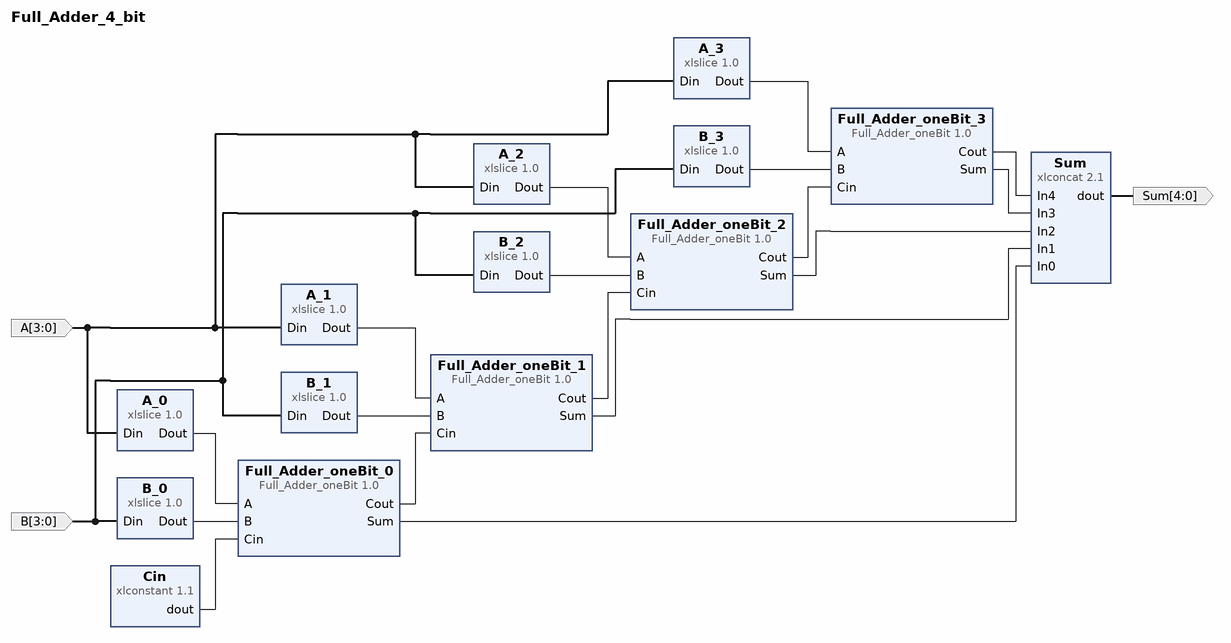
[diagram p0: block diagram of the top level]
# Vivado block design Full_Adder_4_bit, xc7vx485tffg1157-1, Vivado 2025.1
create_bd_design Full_Adder_4_bit

create_bd_port -dir I -from 3 -to 0 A
create_bd_port -dir I -from 3 -to 0 B
create_bd_port -dir O -from 4 -to 0 Sum

create_bd_cell -type ip -vlnv xilinx.com:user:Full_Adder_oneBit:1.0 Full_Adder_oneBit_0
create_bd_cell -type ip -vlnv xilinx.com:ip:xlslice:1.0 A_0
set_property -dict {CONFIG.DIN_WIDTH 4} [get_bd_cells A_0]
create_bd_cell -type ip -vlnv xilinx.com:ip:xlslice:1.0 A_1
set_property -dict {CONFIG.DIN_FROM 1 CONFIG.DIN_TO 1 CONFIG.DIN_WIDTH 4} [get_bd_cells A_1]
create_bd_cell -type ip -vlnv xilinx.com:ip:xlslice:1.0 A_2
set_property -dict {CONFIG.DIN_FROM 2 CONFIG.DIN_TO 2 CONFIG.DIN_WIDTH 4} [get_bd_cells A_2]
create_bd_cell -type ip -vlnv xilinx.com:ip:xlslice:1.0 A_3
set_property -dict {CONFIG.DIN_FROM 3 CONFIG.DIN_TO 3 CONFIG.DIN_WIDTH 4} [get_bd_cells A_3]
create_bd_cell -type ip -vlnv xilinx.com:ip:xlslice:1.0 B_0
set_property -dict {CONFIG.DIN_WIDTH 4} [get_bd_cells B_0]
create_bd_cell -type ip -vlnv xilinx.com:ip:xlslice:1.0 B_1
set_property -dict {CONFIG.DIN_FROM 1 CONFIG.DIN_TO 1 CONFIG.DIN_WIDTH 4} [get_bd_cells B_1]
create_bd_cell -type ip -vlnv xilinx.com:ip:xlslice:1.0 B_2
set_property -dict {CONFIG.DIN_FROM 2 CONFIG.DIN_TO 2 CONFIG.DIN_WIDTH 4} [get_bd_cells B_2]
create_bd_cell -type ip -vlnv xilinx.com:ip:xlslice:1.0 B_3
set_property -dict {CONFIG.DIN_FROM 3 CONFIG.DIN_TO 3 CONFIG.DIN_WIDTH 4} [get_bd_cells B_3]
create_bd_cell -type ip -vlnv xilinx.com:user:Full_Adder_oneBit:1.0 Full_Adder_oneBit_1
create_bd_cell -type ip -vlnv xilinx.com:user:Full_Adder_oneBit:1.0 Full_Adder_oneBit_2
create_bd_cell -type ip -vlnv xilinx.com:user:Full_Adder_oneBit:1.0 Full_Adder_oneBit_3
create_bd_cell -type ip -vlnv xilinx.com:ip:xlconstant:1.1 Cin
set_property -dict {CONFIG.CONST_VAL 0} [get_bd_cells Cin]
create_bd_cell -type ip -vlnv xilinx.com:ip:xlconcat:2.1 Sum
set_property -dict {CONFIG.NUM_PORTS 5} [get_bd_cells Sum]

# ---- connections ----

connect_bd_net [get_bd_pins A_0/Dout] [get_bd_pins Full_Adder_oneBit_0/A]
connect_bd_net [get_bd_ports A] [get_bd_pins A_0/Din] [get_bd_pins A_1/Din] [get_bd_pins A_2/Din] [get_bd_pins A_3/Din]
connect_bd_net [get_bd_pins A_1/Dout] [get_bd_pins Full_Adder_oneBit_1/A]
connect_bd_net [get_bd_pins A_2/Dout] [get_bd_pins Full_Adder_oneBit_2/A]
connect_bd_net [get_bd_pins A_3/Dout] [get_bd_pins Full_Adder_oneBit_3/A]
connect_bd_net [get_bd_pins B_0/Dout] [get_bd_pins Full_Adder_oneBit_0/B]
connect_bd_net [get_bd_pins B_1/Dout] [get_bd_pins Full_Adder_oneBit_1/B]
connect_bd_net [get_bd_pins B_2/Dout] [get_bd_pins Full_Adder_oneBit_2/B]
connect_bd_net [get_bd_pins B_3/Dout] [get_bd_pins Full_Adder_oneBit_3/B]
connect_bd_net [get_bd_ports B] [get_bd_pins B_0/Din] [get_bd_pins B_1/Din] [get_bd_pins B_2/Din] [get_bd_pins B_3/Din]
connect_bd_net [get_bd_pins Cin/dout] [get_bd_pins Full_Adder_oneBit_0/Cin]
connect_bd_net [get_bd_pins Full_Adder_oneBit_0/Cout] [get_bd_pins Full_Adder_oneBit_1/Cin]
connect_bd_net [get_bd_pins Full_Adder_oneBit_0/Sum] [get_bd_pins Sum/In0]
connect_bd_net [get_bd_pins Full_Adder_oneBit_1/Cout] [get_bd_pins Full_Adder_oneBit_2/Cin]
connect_bd_net [get_bd_pins Full_Adder_oneBit_1/Sum] [get_bd_pins Sum/In1]
connect_bd_net [get_bd_pins Full_Adder_oneBit_2/Cout] [get_bd_pins Full_Adder_oneBit_3/Cin]
connect_bd_net [get_bd_pins Full_Adder_oneBit_2/Sum] [get_bd_pins Sum/In2]
connect_bd_net [get_bd_pins Full_Adder_oneBit_3/Cout] [get_bd_pins Sum/In4]
connect_bd_net [get_bd_pins Full_Adder_oneBit_3/Sum] [get_bd_pins Sum/In3]
connect_bd_net [get_bd_pins Sum/dout] [get_bd_ports Sum]

validate_bd_design
save_bd_design
